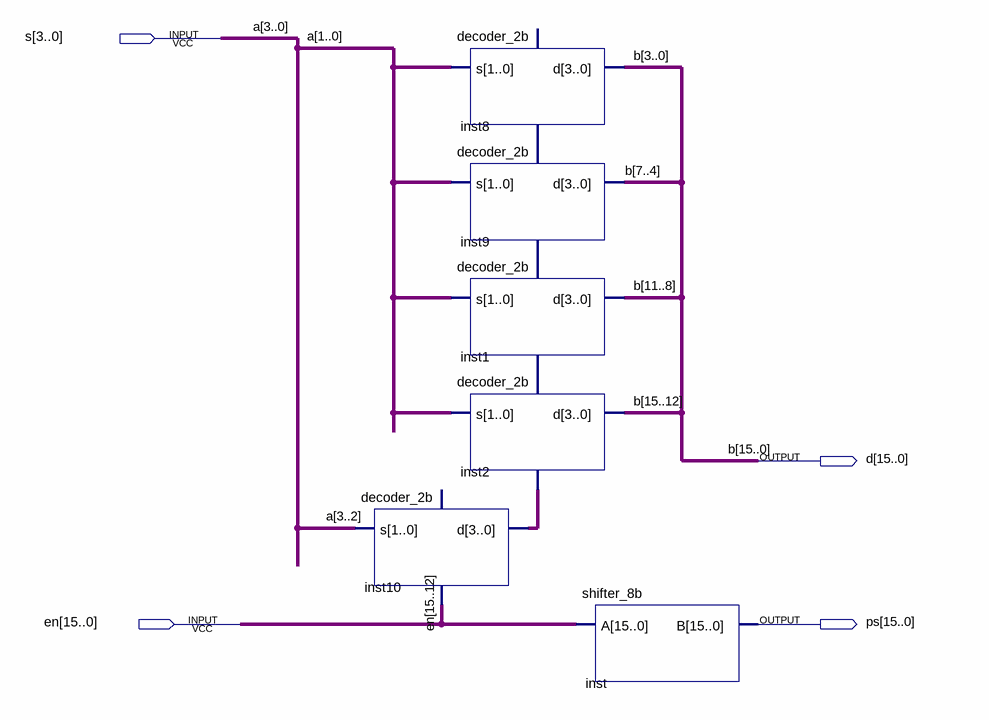
[diagram p0: schematic sheet]
// Quartus schematic decoder_4b.bdf as structural Verilog: 6 symbols, 4 pins
module decoder_4b (
  input  [3:0] s,
  input  [15:0] en,
  output [15:0] d,
  output [15:0] ps
);

  wire [3:0] inst1_ps, inst2_ps, inst9_ps, inst10_d;

  decoder_2b inst10 (.s(s[3:2]), .en(en[15:12]), .d(inst10_d));  // open: ps
  decoder_2b inst8 (.s(s[1:0]), .en(inst9_ps), .d(d[3:0]));  // open: ps
  decoder_2b inst9 (.s(s[1:0]), .en(inst1_ps), .d(d[7:4]), .ps(inst9_ps));
  decoder_2b inst1 (.s(s[1:0]), .en(inst2_ps), .d(d[11:8]), .ps(inst1_ps));
  decoder_2b inst2 (.s(s[1:0]), .en(inst10_d), .d(d[15:12]), .ps(inst2_ps));
  shifter_8b inst (.A(en), .B(ps));

  // Other names for the same wires on the sheet: a[3:0] = s; b[15:0] = d
endmodule
